# EAGLE schematic display_board (EAGLE 5.07)
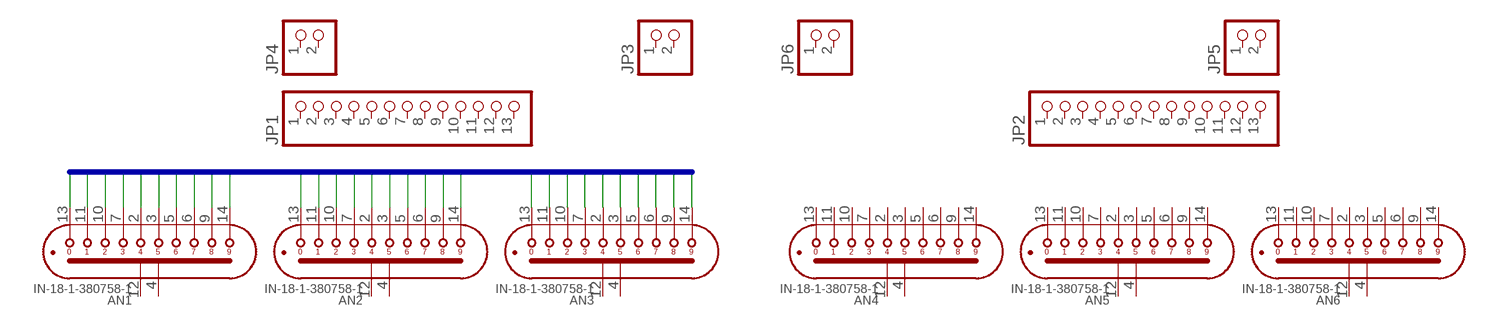
[diagram p0: schematic, sheet 1]

## Parts
AN1  IN-18-1-380758-1  [IN-18-AMP]
AN2  IN-18-1-380758-1  [IN-18-AMP]
AN3  IN-18-1-380758-1  [IN-18-AMP]
AN4  IN-18-1-380758-1  [IN-18-AMP]
AN5  IN-18-1-380758-1  [IN-18-AMP]
AN6  IN-18-1-380758-1  [IN-18-AMP]
JP1  PINHD-1X13  [1X13]
JP2  PINHD-1X13  [1X13]
JP3  PINHD-1X2  [1X02]
JP4  PINHD-1X2  [1X02]
JP5  PINHD-1X2  [1X02]
JP6  PINHD-1X2  [1X02]

## Nets
LC0: AN1.13 AN2.13 AN3.13
LC1: AN1.11 AN2.11 AN3.11
LC2: AN1.10 AN2.10 AN3.10
LC3: AN1.7 AN2.7 AN3.7
LC4: AN1.2 AN2.2 AN3.2
LC5: AN1.3 AN2.3 AN2.5 AN3.3
LC6: AN1.5 AN3.5
LC7: AN1.6 AN2.6 AN3.6
LC8: AN1.9 AN2.9 AN3.9
LC9: AN1.14 AN2.14 AN3.14
Unconnected: AN1.4(A1) AN1.12(A2) AN2.4(A1) AN2.12(A2) AN3.4(A1) AN3.12(A2) AN4.2 AN4.3 AN4.4(A1) AN4.5 AN4.6 AN4.7 AN4.9 AN4.10 AN4.11 AN4.12(A2) AN4.13 AN4.14 AN5.2 AN5.3 AN5.4(A1) AN5.5 AN5.6 AN5.7 AN5.9 AN5.10 AN5.11 AN5.12(A2) AN5.13 AN5.14 AN6.2 AN6.3 AN6.4(A1) AN6.5 AN6.6 AN6.7 AN6.9 AN6.10 AN6.11 AN6.12(A2) AN6.13 AN6.14 JP1.1 JP1.2 JP1.3 JP1.4 JP1.5 JP1.6 JP1.7 JP1.8 JP1.9 JP1.10 JP1.11 JP1.12 JP1.13 JP2.1 JP2.2 JP2.3 JP2.4 JP2.5 JP2.6 JP2.7 JP2.8 JP2.9 JP2.10 JP2.11 JP2.12 JP2.13 JP3.1 JP3.2 JP4.1 JP4.2 JP5.1 JP5.2 JP6.1 JP6.2

## Buses
LC[0..9]

## Library data of the parts
AN1-AN6 = nixie_tube:IN-18: Indicator Tube (numeral height 40mm, no filter, side view)
JP1 JP2 = pinhead:PINHD-1X13: PIN HEADER
JP3-JP6 = pinhead:PINHD-1X2: PIN HEADER